# Altium schematic sheet CPU部分.SchDoc
size A4
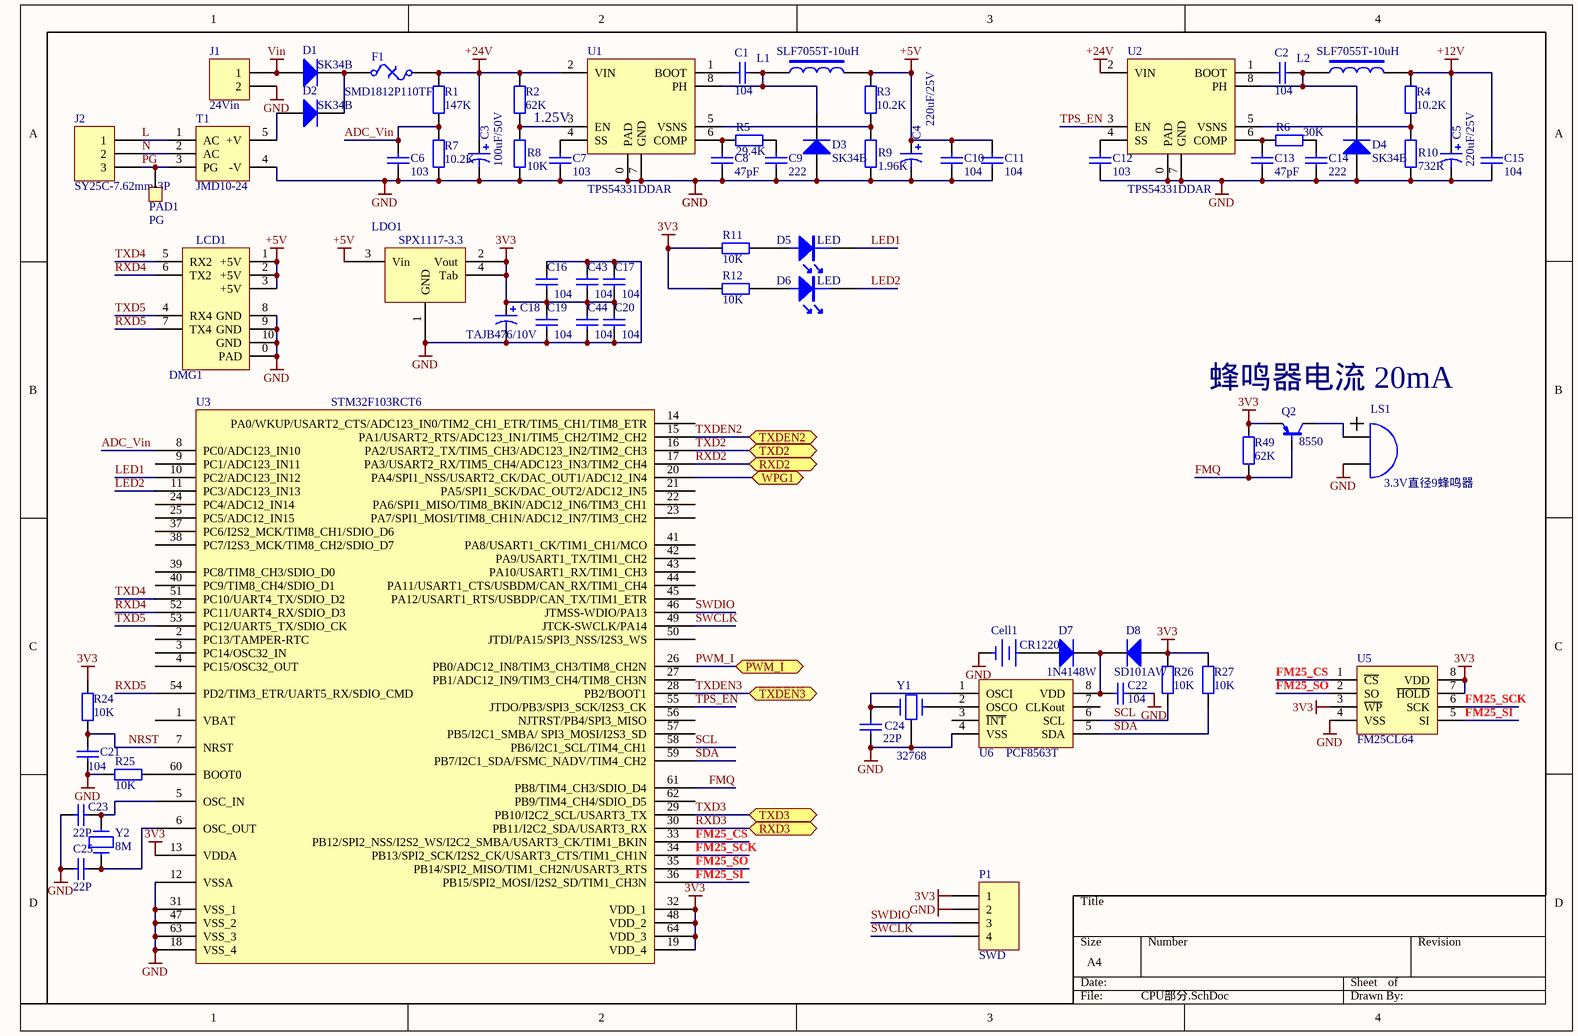
[diagram p0: CPU部分.SchDoc]

## Parts
C1  104  [C 0603_M]
C2  104  [C 0603_M]
C3  100uF/50V  [CT 10*8 - R]
C4  220uF/25V  [CT 10*8 - R]
C5  220uF/25V  [CT 10*8 - R]
C6  103  [C 0603_M]
C7  103  [C 0603_M]
C8  47pF  [C 0603_M]
C9  222  [C 0603_M]
C10  104  [C 0603_M]
C11  104  [C 0603_M]
C12  103  [C 0603_M]
C13  47pF  [C 0603_M]
C14  222  [C 0603_M]
C15  104  [C 0603_M]
C16  104  [C 0603_M]
C17  104  [C 0603_M]
C18  TAJB476/10V  [3528]
C19  104  [C 0603_M]
C20  104  [C 0603_M]
C21  104  [C 0603_M]
C22  104  [C 0603_M]
C23  22P  [C 0603_M]
C24  22P  [C 0603_M]
C25  22P  [C 0603_M]
C43  104  [C 0603_M]
C44  104  [C 0603_M]
Cell1  CR1220  [BT-3V]
D1  SK34B  [SK34B]
D2  SK34B  [SK34B]
D3  SK34B  [SK34B]
D4  SK34B  [SK34B]
D5  LED  [D0603]
D6  LED  [D0603]
D7  1N4148W  [SOD-123]
D8  SD101AW  [SOD-123]
DMG1  LCD1  [FCC1.0*10]
F1  SMD1812P110TF  [1812]
J1  24Vin  [KF128-5.08-2P]
J2  SY25C-7.62mm-3P  [T31-3]
L1  SLF7055T-10uH  [SLF7032]
L2  SLF7055T-10uH  [SLF7032]
LDO1  SPX1117-3.3  [SOT-223]
LS1  3.3V直径9蜂鸣器  [FMQ_9MM]
P1  SWD  [HDR1X4]
PAD1  PG  [D4.5]
Q2  8550  [SOT-23]
R1  147K  [R 0603_M]
R2  62K  [R 0603_M]
R3  10.2K  [R 0603_M]
R4  10.2K  [R 0603_M]
R5  29.4K  [R 0603_M]
R6  30K  [R 0603_M]
R7  10.2K  [R 0603_M]
R8  10K  [R 0603_M]
R9  1.96K  [R 0603_M]
R10  732R  [R 0603_M]
R11  10K  [R 0603_M]
R12  10K  [R 0603_M]
R24  10K  [R 0603_M]
R25  10K  [R 0603_M]
R26  10K  [R 0603_M]
R27  10K  [R 0603_M]
R49  62K  [R 0603_M]
T1  JMD10-24  [JMD10-24]
U1  TPS54331DDAR  [SO_PAD-8]
U2  TPS54331DDAR  [SO_PAD-8]
U3  STM32F103RCT6  [QFP64]
U5  FM25CL64  [SO-8]
U6  PCF8563T  [SO-8]
Y1  32768  [32768]
Y2  8M  [OSC HC-49SMD]

## Ports
PWM_I (bidir), RXD2 (bidir), RXD3 (bidir), TXD2 (bidir), TXD3 (bidir), TXDEN2 (bidir), TXDEN3 (bidir), WPG1

## Nets
3V3: C16.1 C17.1 C18.1 C19.2 C20.2 C43.1 C44.2 D8.1(A) LDO1.2(Vout) LDO1.4(Tab) P1.1 Q2.2(e) R11.2 R12.2 R24.1 R26.1 R27.2 R49.2 U3.13(VDDA) U3.19(VDD_4) U3.32(VDD_1) U3.48(VDD_2) U3.64(VDD_3) U5.3(~{WP}) U5.7(~{HOLD}) U5.8(VDD)
+5V: C4.1 C10.1 C11.1 DMG1.1(+5V) DMG1.2(+5V) DMG1.3(+5V) L1.2 LDO1.3(Vin) R3.1
+12V: C5.1 C15.1 L2.2 R4.1
+24V: C3.1 F1.1 R1.1 R2.1 U1.2(VIN) U2.2(VIN)
GND: C3.2 C4.2 C5.2 C6.2 C7.2 C8.2 C9.2 C10.2 C11.2 C12.2 C13.2 C14.2 C15.2 C16.2 C17.2 C18.2 C19.1 C20.1 C21.1 C22.1 C23.2 C24.1 C25.2 C43.2 C44.1 Cell1.2 D3.1(A) D4.1(A) DMG1.0(PAD) DMG1.8(GND) DMG1.9(GND) DMG1.10(GND) J1.2 LDO1.1(GND) LS1.2(B) P1.2 R7.1 R8.2 R9.2 R10.2 R25.2 T1.4(-V) U1.0(PAD) U1.7(GND) U2.0(PAD) U2.7(GND) U3.12(VSSA) U3.18(VSS_4) U3.31(VSS_1) U3.47(VSS_2) U3.63(VSS_3) U5.4(VSS) U6.4(VSS) Y1.3
Vin: D1.1(A) J1.1
ADC_Vin: C6.1 R1.2 R7.2 U3.8(PC0/ADC123_IN10)
FM25_CS: U3.33(PB12/SPI2_NSS/I2S2_WS/I2C2_SMBA/USART3_CK/TIM1_BKIN) U5.1(~{CS})
FM25_SCK: U3.34(PB13/SPI2_SCK/I2S2_CK/USART3_CTS/TIM1_CH1N) U5.6(SCK)
FM25_SI: U3.36(PB15/SPI2_MOSI/I2S2_SD/TIM1_CH3N) U5.5(SI)
FM25_SO: U3.35(PB14/SPI2_MISO/TIM1_CH2N/USART3_RTS) U5.2(SO)
FMQ: Q2.1(b) R49.1 U3.61(PB8/TIM4_CH3/SDIO_D4)
L: J2.1 T1.1(AC)
LED1: D5.K U3.10(PC2/ADC123_IN12)
LED2: D6.K U3.11(PC3/ADC123_IN13)
N: J2.2 T1.2(AC)
NRST: C21.2 R24.2 U3.7(NRST)
PG: J2.3 PAD1.1 T1.3(PG)
PWM_I: U3.26(PB0/ADC12_IN8/TIM3_CH3/TIM8_CH2N) ; port PWM_I
RXD2: U3.17(PA3/USART2_RX/TIM5_CH4/ADC123_IN3/TIM2_CH4) ; port RXD2
RXD3: U3.30(PB11/I2C2_SDA/USART3_RX) ; port RXD3
RXD4: DMG1.6(TX2) U3.52(PC11/UART4_RX/SDIO_D3)
RXD5: DMG1.7(TX4) U3.54(PD2/TIM3_ETR/UART5_RX/SDIO_CMD)
SCL: R26.2 U3.58(PB6/I2C1_SCL/TIM4_CH1) U6.6(SCL)
SDA: R27.1 U3.59(PB7/I2C1_SDA/FSMC_NADV/TIM4_CH2) U6.5(SDA)
SWCLK: P1.4 U3.49(JTCK-SWCLK/PA14)
SWDIO: P1.3 U3.46(JTMSS-WDIO/PA13)
TPS_EN: U2.3(EN) U3.55(JTDO/PB3/SPI3_SCK/I2S3_CK)
TXD2: U3.16(PA2/USART2_TX/TIM5_CH3/ADC123_IN2/TIM2_CH3) ; port TXD2
TXD3: U3.29(PB10/I2C2_SCL/USART3_TX) ; port TXD3
TXD4: DMG1.5(RX2) U3.51(PC10/UART4_TX/SDIO_D2)
TXD5: DMG1.4(RX4) U3.53(PC12/UART5_TX/SDIO_CK)
TXDEN2: U3.15(PA1/USART2_RTS/ADC123_IN1/TIM5_CH2/TIM2_CH2) ; port TXDEN2
TXDEN3: U3.28(PB2/BOOT1) ; port TXDEN3
WPG1: U3.20(PA4/SPI1_NSS/USART2_CK/DAC_OUT1/ADC12_IN4) ; port WPG1
NetC1_1: C1.1 D3.2(K) L1.1 U1.8(PH)
NetC1_2: C1.2 U1.1(BOOT)
NetC2_1: C2.1 D4.2(K) L2.1 U2.8(PH)
NetC2_2: C2.2 U2.1(BOOT)
NetC7_1: C7.1 U1.4(SS)
NetC8_1: C8.1 R5.1 U1.6(COMP)
NetC9_1: C9.1 R5.2
NetC12_1: C12.1 U2.4(SS)
NetC13_1: C13.1 R6.1 U2.6(COMP)
NetC14_1: C14.1 R6.2
NetC22_2: C22.2 D7.2(K) D8.2(K) U6.8(VDD)
NetC23_1: C23.1 U3.5(OSC_IN) Y2.1
NetC24_2: C24.2 U6.1(OSCI) Y1.2
NetC25_1: C25.1 U3.6(OSC_OUT) Y2.2
NetCell1_1: Cell1.1 D7.1(A)
NetD1_2: D1.2(K) D2.2(K) F1.2
NetD2_1: D2.1(A) T1.5(+V)
NetD5_A: D5.A R11.1
NetD6_A: D6.A R12.1
NetLS1_1: LS1.1(A) Q2.3(c)
NetR2_2: R2.2 R8.1 U1.3(EN)
NetR3_2: R3.2 R9.1 U1.5(VSNS)
NetR4_2: R4.2 R10.1 U2.5(VSNS)
NetR25_1: R25.1 U3.60(BOOT0)
NetU6_2: U6.2(OSCO) Y1.1

Not connected (* = marked no-connect by the designer): U3 1(VBAT) 2(PC13/TAMPER-RTC) 3(PC14/OSC32_IN) 4(PC15/OSC32_OUT) 9(PC1/ADC123_IN11) 14(PA0/WKUP/USART2_CTS/ADC123_IN0/TIM2_CH1_ETR/TIM5_CH1/TIM8_ETR) 21(PA5/SPI1_SCK/DAC_OUT2/ADC12_IN5) 22(PA6/SPI1_MISO/TIM8_BKIN/ADC12_IN6/TIM3_CH1) 23(PA7/SPI1_MOSI/TIM8_CH1N/ADC12_IN7/TIM3_CH2) 24(PC4/ADC12_IN14) 25(PC5/ADC12_IN15) 27(PB1/ADC12_IN9/TIM3_CH4/TIM8_CH3N) 37(PC6/I2S2_MCK/TIM8_CH1/SDIO_D6) 38(PC7/I2S3_MCK/TIM8_CH2/SDIO_D7) 39(PC8/TIM8_CH3/SDIO_D0) 40(PC9/TIM8_CH4/SDIO_D1) 41(PA8/USART1_CK/TIM1_CH1/MCO) 42(PA9/USART1_TX/TIM1_CH2) 43(PA10/USART1_RX/TIM1_CH3) 44(PA11/USART1_CTS/USBDM/CAN_RX/TIM1_CH4) 45(PA12/USART1_RTS/USBDP/CAN_TX/TIM1_ETR) 50(JTDI/PA15/SPI3_NSS/I2S3_WS) 56(NJTRST/PB4/SPI3_MISO) 57(PB5/I2C1_SMBA/_SPI3_MOSI/I2S3_SD) 62(PB9/TIM4_CH4/SDIO_D5); U6 3(~{INT}) 7(CLKout)

## Notes on the sheet
- 1.25V
- 蜂鸣器电流 20mA

## Library data of the parts
C1 C2 C6-C17 C19 C20 C22 C43 C44 = Cap Semi: Capacitor (Semiconductor SIM Model); Published: 8-Jun-2000; LatestRevisionDate: 17-Jul-2002; LatestRevisionNote: Re-released for DXP Platform.; PackageReference: C1206; Publisher: Altium Limited
C3-C5 C18 = Cap Pol1: Polarized Capacitor (Radial)
  C18: Published: 8-Jun-2000; LatestRevisionDate: 17-Jul-2002; LatestRevisionNote: Re-released for DXP Platform.; PackageReference: RB7.6-15; Publisher: Altium Limited
C21 C23-C25 = Cap: Capacitor; Published: 8-Jun-2000; LatestRevisionDate: 17-Jul-2002; LatestRevisionNote: Re-released for DXP Platform.; PackageReference: RAD-0.3; Publisher: Altium Limited
Cell1 = Cell
D1-D4 D7 D8 = Diode 1N4007: 1 Amp General Purpose Rectifier; Published: 8-Jun-2000; LatestRevisionDate: 17-Jul-2002; LatestRevisionNote: Re-released for DXP Platform.; DatasheetDocument: 1998; PackageDocument: Aug-1999; PackageReference: DO-41; Publisher: Altium Limited; Code_JEDEC: DO-204-AL; ComponentLink1Description: Manufacturer Link; ComponentLink1URL: http://www.fairchildsemi.com/; ComponentLink2Description: Datasheet; ComponentLink2URL: http://www.fairchildsemi.com/ds/1N%2F1N4001.pdf
D5 D6 = LED: RED
DMG1 = DMG48480C040
F1 = Fuse Thermal: Thermal Fuse; Published: 24-Mar-1999; LatestRevisionDate: 17-Jul-2002; LatestRevisionNote: Re-released for DXP Platform.; PackageReference: PIN-W2/E2.8; Publisher: 200mA
J1 = Header 2: Header, 2-Pin; LatestRevisionDate: 17-Jul-2002; LatestRevisionNote: Re-released for DXP Platform.; Publisher: Altium Limited
J2 = Header 3: Header, 3-Pin; LatestRevisionDate: 17-Jul-2002; LatestRevisionNote: Re-released for DXP Platform.; Publisher: Altium Limited
L1 L2 = INDUCTOR2
LDO1 = 1117
LS1 = Bell: Electrical Bell; Published: 24-Mar-1999; LatestRevisionDate: 17-Jul-2002; LatestRevisionNote: Re-released for DXP Platform.; PackageReference: PIN2; Publisher: Altium Limited
P1 = Header 4: Header, 4-Pin; LatestRevisionDate: 17-Jul-2002; LatestRevisionNote: Re-released for DXP Platform.; Publisher: Altium Limited
PAD1 = test
Q2 = PNP
R1-R12 R24-R27 R49 = Res2: Resistor; Published: 8-Jun-2000; LatestRevisionDate: 17-Jul-2002; LatestRevisionNote: Re-released for DXP Platform.; PackageReference: AXIAL-0.4; Publisher: Altium Limited
U1 U2 = TPS54331
Y1 Y2 = CRYSTAL